# EAGLE design staff-pdb-a (EAGLE 9.6.2)
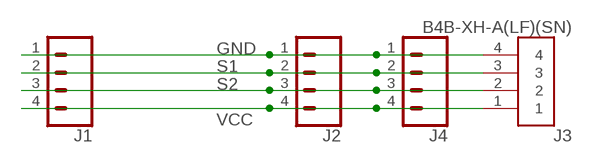
[diagram p0: schematic, sheet 1]

## Parts
J1  CONN_04  [1X04]
J2  CONN_04  [1X04]
J3  B4B-XH-A(LF)(SN)  [JST_B4B-XH-A(LF)(SN)]
J4  CONN_04  [1X04]

## Nets
GND: J1.1 J2.1 J3.4 J4.1
S1: J1.2 J2.2 J3.3 J4.2
S2: J1.3 J2.3 J3.2 J4.3
VCC: J1.4 J2.4 J3.1 J4.4

## Library data of the parts
J1 J2 J4 = RoverWing-cover-V1.6:CONN_04: Multi connection point. Often used as Generic Header-pin footprint for 0.1 inch spaced/style header connections On any of the 0.1 inch spaced packages, you can populate with these: Break Away Headers - Straight <https://www.sparkfun.com/products/116> (PRT-00116) Break Away Male Headers - Right Angle <https://www.sparkfun.com/products/553> (PRT-00553) Female Headers <https://www.sparkfun.com/products/115> (PRT-00115) Break Away Headers - Machine Pin <https://www.sparkfun.com/products/117> (PRT-00117) Break Away Female Headers - Swiss Machine Pin <https://www.sparkfun.com/products/743> (PRT-00743) For SCREWTERMINALS and SPRING TERMINALS visit here: Screw Terimnals on SparkFun.com <https://www.sparkfun.com/search/results?term=Screw+Terminals> (5mm/3.5mm/2.54mm spacing) This device is also useful as a general connection point to wire up your design to another part of your project. Our various solder wires solder well into these plated through hole pads. Hook-Up Wire - Assortment (Stranded, 22 AWG) <https://www.sparkfun.com/products/11375> (PRT-11375) Hook-Up Wire - Assortment (Solid Core, 22 AWG) <https://www.sparkfun.com/products/11367> (PRT-11367) View the entire wire category on our website here <https://www.sparkfun.com/categories/141> Special notes: Molex polarized connector foot print use with SKU : PRT-08231 with associated crimp pins and housings. 1MM SMD Version SKU: PRT-10208; PROD_ID: CONN-09696
J3 = RoverWing-V1.5:B4B-XH-A(LF)(SN): XH Series 4 Position 2.5 mm Pitch Through Hole Crimp Top Entry Shrouded Header; DESCRIPTION: Connector Header Through Hole 4 position 0.098 (2.50mm); DIGI-KEY_PART_NUMBER: 455-2249-ND; DIGIKEY-PURCHASE-URL: https://snapeda.com/shop?store=DigiKey&id=447494; MF: JST Sales; MP: B4B-XH-A(LF)(SN); PACKAGE: None

## Board
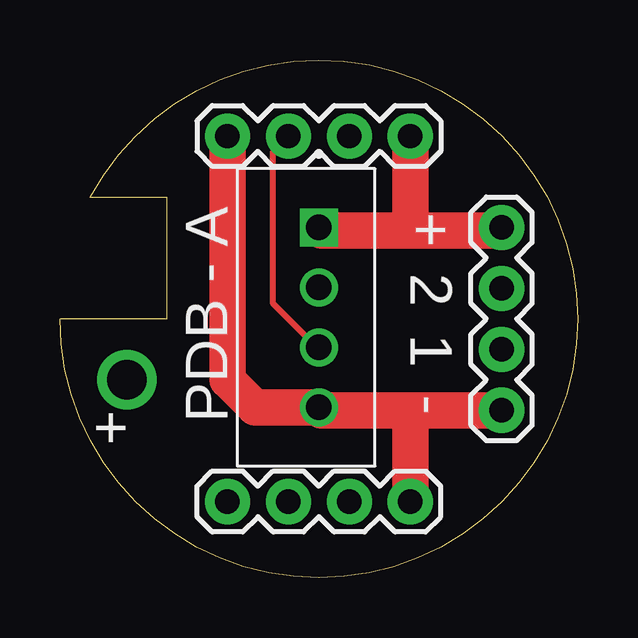
[diagram p1: board, top side]
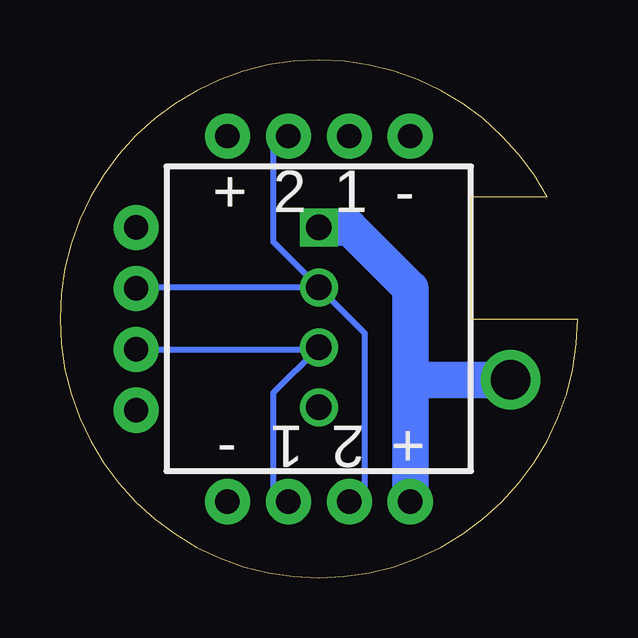
[diagram p2: board, bottom side, seen from below]

Size 21.59 x 21.59 mm. Coordinates in mm from the lower left corner, seen from the top.
Outline: 1.27,15.88 arc-152 21.59,10.79 arc-180 0,10.79 4.45,10.79 4.45,15.88 1.27,15.88
Copper layers (1*16): Top 0.035mm / dielectric 1.5mm / Bottom 0.035mm
Design rules "default": minimum track width 6mil, minimum drill 0.35mm, track to track 6mil, track to pad 6mil, pad to pad 6mil, via to via 6mil, smd to smd 6mil, copper to edge 40mil, drill to drill 6mil, minimum pad ring 10mil, minimum via ring 8mil, stop-mask expansion 4mil, vias tented up to drill 0mil, thermal gap 10mil

### Footprints (pad centres in the part's own frame; a part is rotated, then mirrored left to right if it is on the bottom)
1X04 = drill 1.016 pad 1.88: 1 0,0; 2 2.54,0; 3 5.08,0; 4 7.62,0
JST_B4B-XH-A(LF)(SN) = drill 1.06 square: 1 0,0 | drill 1.06: 2 2.5,0; 3 5,0; 4 7.5,0

### Placement (x,y rotation side)
J1  6.98,18.41 0 top
J2  14.61,3.17 180 top
J3  10.79,14.61 270 top
J4  18.41,6.98 90 top

### Tracks (layer width: path | path; a pad name or v marks a point on that pad's centre or on a via)
GND
  Top 1.016: 10.91,6.98 J3.4
  Top 1.524: 14.61,6.98 J4.1 | J2.1 14.61,6.98 | 14.61,6.98 10.91,6.98 | J3.4 8.13,7.11 6.98,8.25 J1.1
S1
  Top 0.254: J1.2 8.89,17.78 8.89,11.43 10.71,9.61 J3.3
  Bottom 0.254: J2.2 12.7,3.81 12.7,7.7 J3.3 10.88,9.53 J4.2
S2
  Bottom 0.254: J3.2 12.7,14.01 12.7,17.78 J1.3 | J2.3 8.89,3.81 8.89,10.2 J3.2 | J3.2 18.38,12.11 J4.3
VCC  (via drill 1.65)
  Top 1.016: 18.3,14.48 J4.4 | 10.91,14.48 J3.1
  Top 1.524: 10.91,14.48 14.61,14.48 | 14.61,14.48 18.3,14.48 | J1.4 14.61,14.48
  Bottom 1.524: J3.1 9.53,14.61 6.98,12.06 6.98,8.25 | J2.4 6.98,8.25 | v2.79,8.25 6.98,8.25

### Text on the board
tPlace: PDB - A
tNames: + | 2 | 1 | - | +
bNames: - | 1 | 2 | + | + | 2 | 1 | -